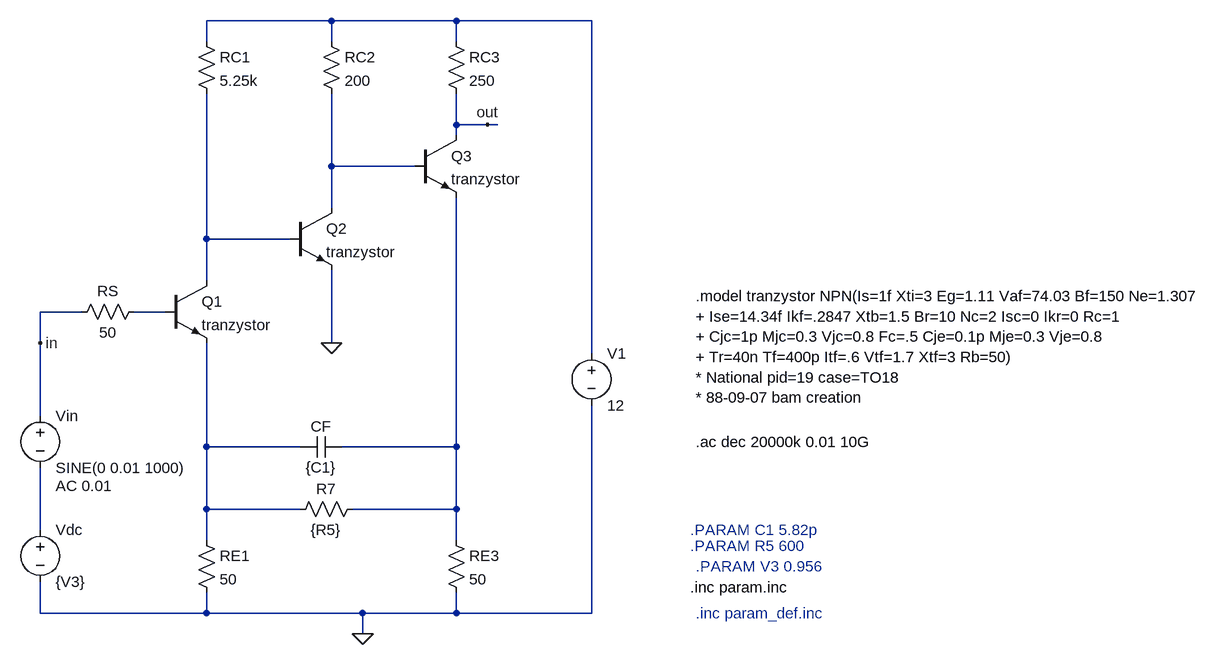
[diagram p0: schematic schemat1.asc]
schemat1.asc, the LTspice schematic file:
Version 4
SHEET 1 1724 680
WIRE 208 -288 16 -288
WIRE 400 -288 208 -288
WIRE 608 -288 400 -288
WIRE 16 -256 16 -288
WIRE 208 -256 208 -288
WIRE 400 -256 400 -288
WIRE 400 -128 400 -176
WIRE 448 -128 400 -128
WIRE 464 -128 448 -128
WIRE 400 -112 400 -128
WIRE 208 -64 208 -176
WIRE 336 -64 208 -64
WIRE 208 0 208 -64
WIRE 16 48 16 -176
WIRE 144 48 16 48
WIRE 16 112 16 48
WIRE -176 160 -240 160
WIRE -48 160 -96 160
WIRE -240 208 -240 160
WIRE 208 208 208 96
WIRE 608 224 608 -288
WIRE -240 320 -240 208
WIRE 16 368 16 208
WIRE 160 368 16 368
WIRE 400 368 400 -16
WIRE 400 368 224 368
WIRE 16 464 16 368
WIRE 160 464 16 464
WIRE 400 464 400 368
WIRE 400 464 240 464
WIRE -240 496 -240 400
WIRE 16 512 16 464
WIRE 400 512 400 464
WIRE -240 624 -240 576
WIRE 16 624 16 592
WIRE 16 624 -240 624
WIRE 256 624 16 624
WIRE 400 624 400 592
WIRE 400 624 256 624
WIRE 608 624 608 304
WIRE 608 624 400 624
WIRE 256 656 256 624
FLAG 208 208 0
FLAG 256 656 0
FLAG 448 -128 out
FLAG -240 208 in
SYMBOL npn -48 112 R0
SYMATTR InstName Q1
SYMATTR Value tranzystor
SYMBOL npn 144 0 R0
SYMATTR InstName Q2
SYMATTR Value tranzystor
SYMBOL npn 336 -112 R0
SYMATTR InstName Q3
SYMATTR Value tranzystor
SYMBOL cap 224 352 R90
WINDOW 0 0 32 VBottom 2
WINDOW 3 32 32 VTop 2
SYMATTR InstName CF
SYMATTR Value {C1}
SYMBOL res -80 144 R90
WINDOW 0 0 56 VBottom 2
WINDOW 3 32 56 VTop 2
SYMATTR InstName RS
SYMATTR Value 50
SYMBOL res 384 -272 R0
SYMATTR InstName RC3
SYMATTR Value 250
SYMBOL res 192 -272 R0
SYMATTR InstName RC2
SYMATTR Value 200
SYMBOL res 0 -272 R0
SYMATTR InstName RC1
SYMATTR Value 5.25k
SYMBOL res 0 496 R0
SYMATTR InstName RE1
SYMATTR Value 50
SYMBOL res 384 496 R0
SYMATTR InstName RE3
SYMATTR Value 50
SYMBOL voltage -240 480 R0
SYMATTR InstName Vdc
SYMATTR Value {V3}
SYMBOL voltage -240 304 R0
WINDOW 123 24 124 Left 2
WINDOW 39 0 0 Left 2
SYMATTR Value2 AC 0.01
SYMATTR InstName Vin
SYMATTR Value SINE(0 0.01 1000)
SYMBOL voltage 608 208 R0
SYMATTR InstName V1
SYMATTR Value 12
SYMBOL res 256 448 R90
WINDOW 0 0 56 VBottom 2
WINDOW 3 32 56 VTop 2
SYMATTR InstName R7
SYMATTR Value {R5}
TEXT 768 136 Left 2 !.model tranzystor NPN(Is=1f Xti=3 Eg=1.11 Vaf=74.03 Bf=150 Ne=1.307\n+ Ise=14.34f Ikf=.2847 Xtb=1.5 Br=10 Nc=2 Isc=0 Ikr=0 Rc=1\n+ Cjc=1p Mjc=0.3 Vjc=0.8 Fc=.5 Cje=0.1p Mje=0.3 Vje=0.8\n+ Tr=40n Tf=400p Itf=.6 Vtf=1.7 Xtf=3 Rb=50)\n* National pid=19 case=TO18\n* 88-09-07 bam creation
TEXT 768 360 Left 2 !.ac dec 20000k 0.01 10G
TEXT 760 584 Left 2 !.inc param.inc
TEXT 760 496 Left 2 ;.PARAM C1 5.82p
TEXT 760 520 Left 2 ;.PARAM R5 600
TEXT 768 552 Left 2 ;.PARAM V3 0.956
TEXT 768 624 Left 2 ;.inc param_def.inc

The netlist it stands for:
* schemat1.asc
Q1 N003 N004 N005 0 tranzystor
Q2 N002 N003 0 0 tranzystor
Q3 out N002 N006 0 tranzystor
CF N006 N005 {C1}
RS N004 in 50
RC3 N001 out 250
RC2 N001 N002 200
RC1 N001 N003 5.25k
RE1 N005 0 50
RE3 N006 0 50
Vdc N007 0 {V3}
Vin in N007 SINE(0 0.01 1000) AC 0.01
V1 N001 0 12
R7 N006 N005 {R5}
.model NPN NPN
.model PNP PNP
.lib standard.bjt
.model tranzystor NPN(Is=1f Xti=3 Eg=1.11 Vaf=74.03 Bf=150 Ne=1.307
+ Ise=14.34f Ikf=.2847 Xtb=1.5 Br=10 Nc=2 Isc=0 Ikr=0 Rc=1
+ Cjc=1p Mjc=0.3 Vjc=0.8 Fc=.5 Cje=0.1p Mje=0.3 Vje=0.8
+ Tr=40n Tf=400p Itf=.6 Vtf=1.7 Xtf=3 Rb=50)
* National pid=19 case=TO18
* 88-09-07 bam creation
.ac dec 20000k 0.01 10G
.inc param.inc
* .PARAM C1 5.82p
* .PARAM R5 600
* .PARAM V3 0.956
* .inc param_def.inc
.backanno
.end